# EasyEDA schematic Smart spectacles for drowsiness.json
TITLE: Smart spectacles for drowsiness; REV: 1.0; Date: 2022-01-13; Sheet: 1/1
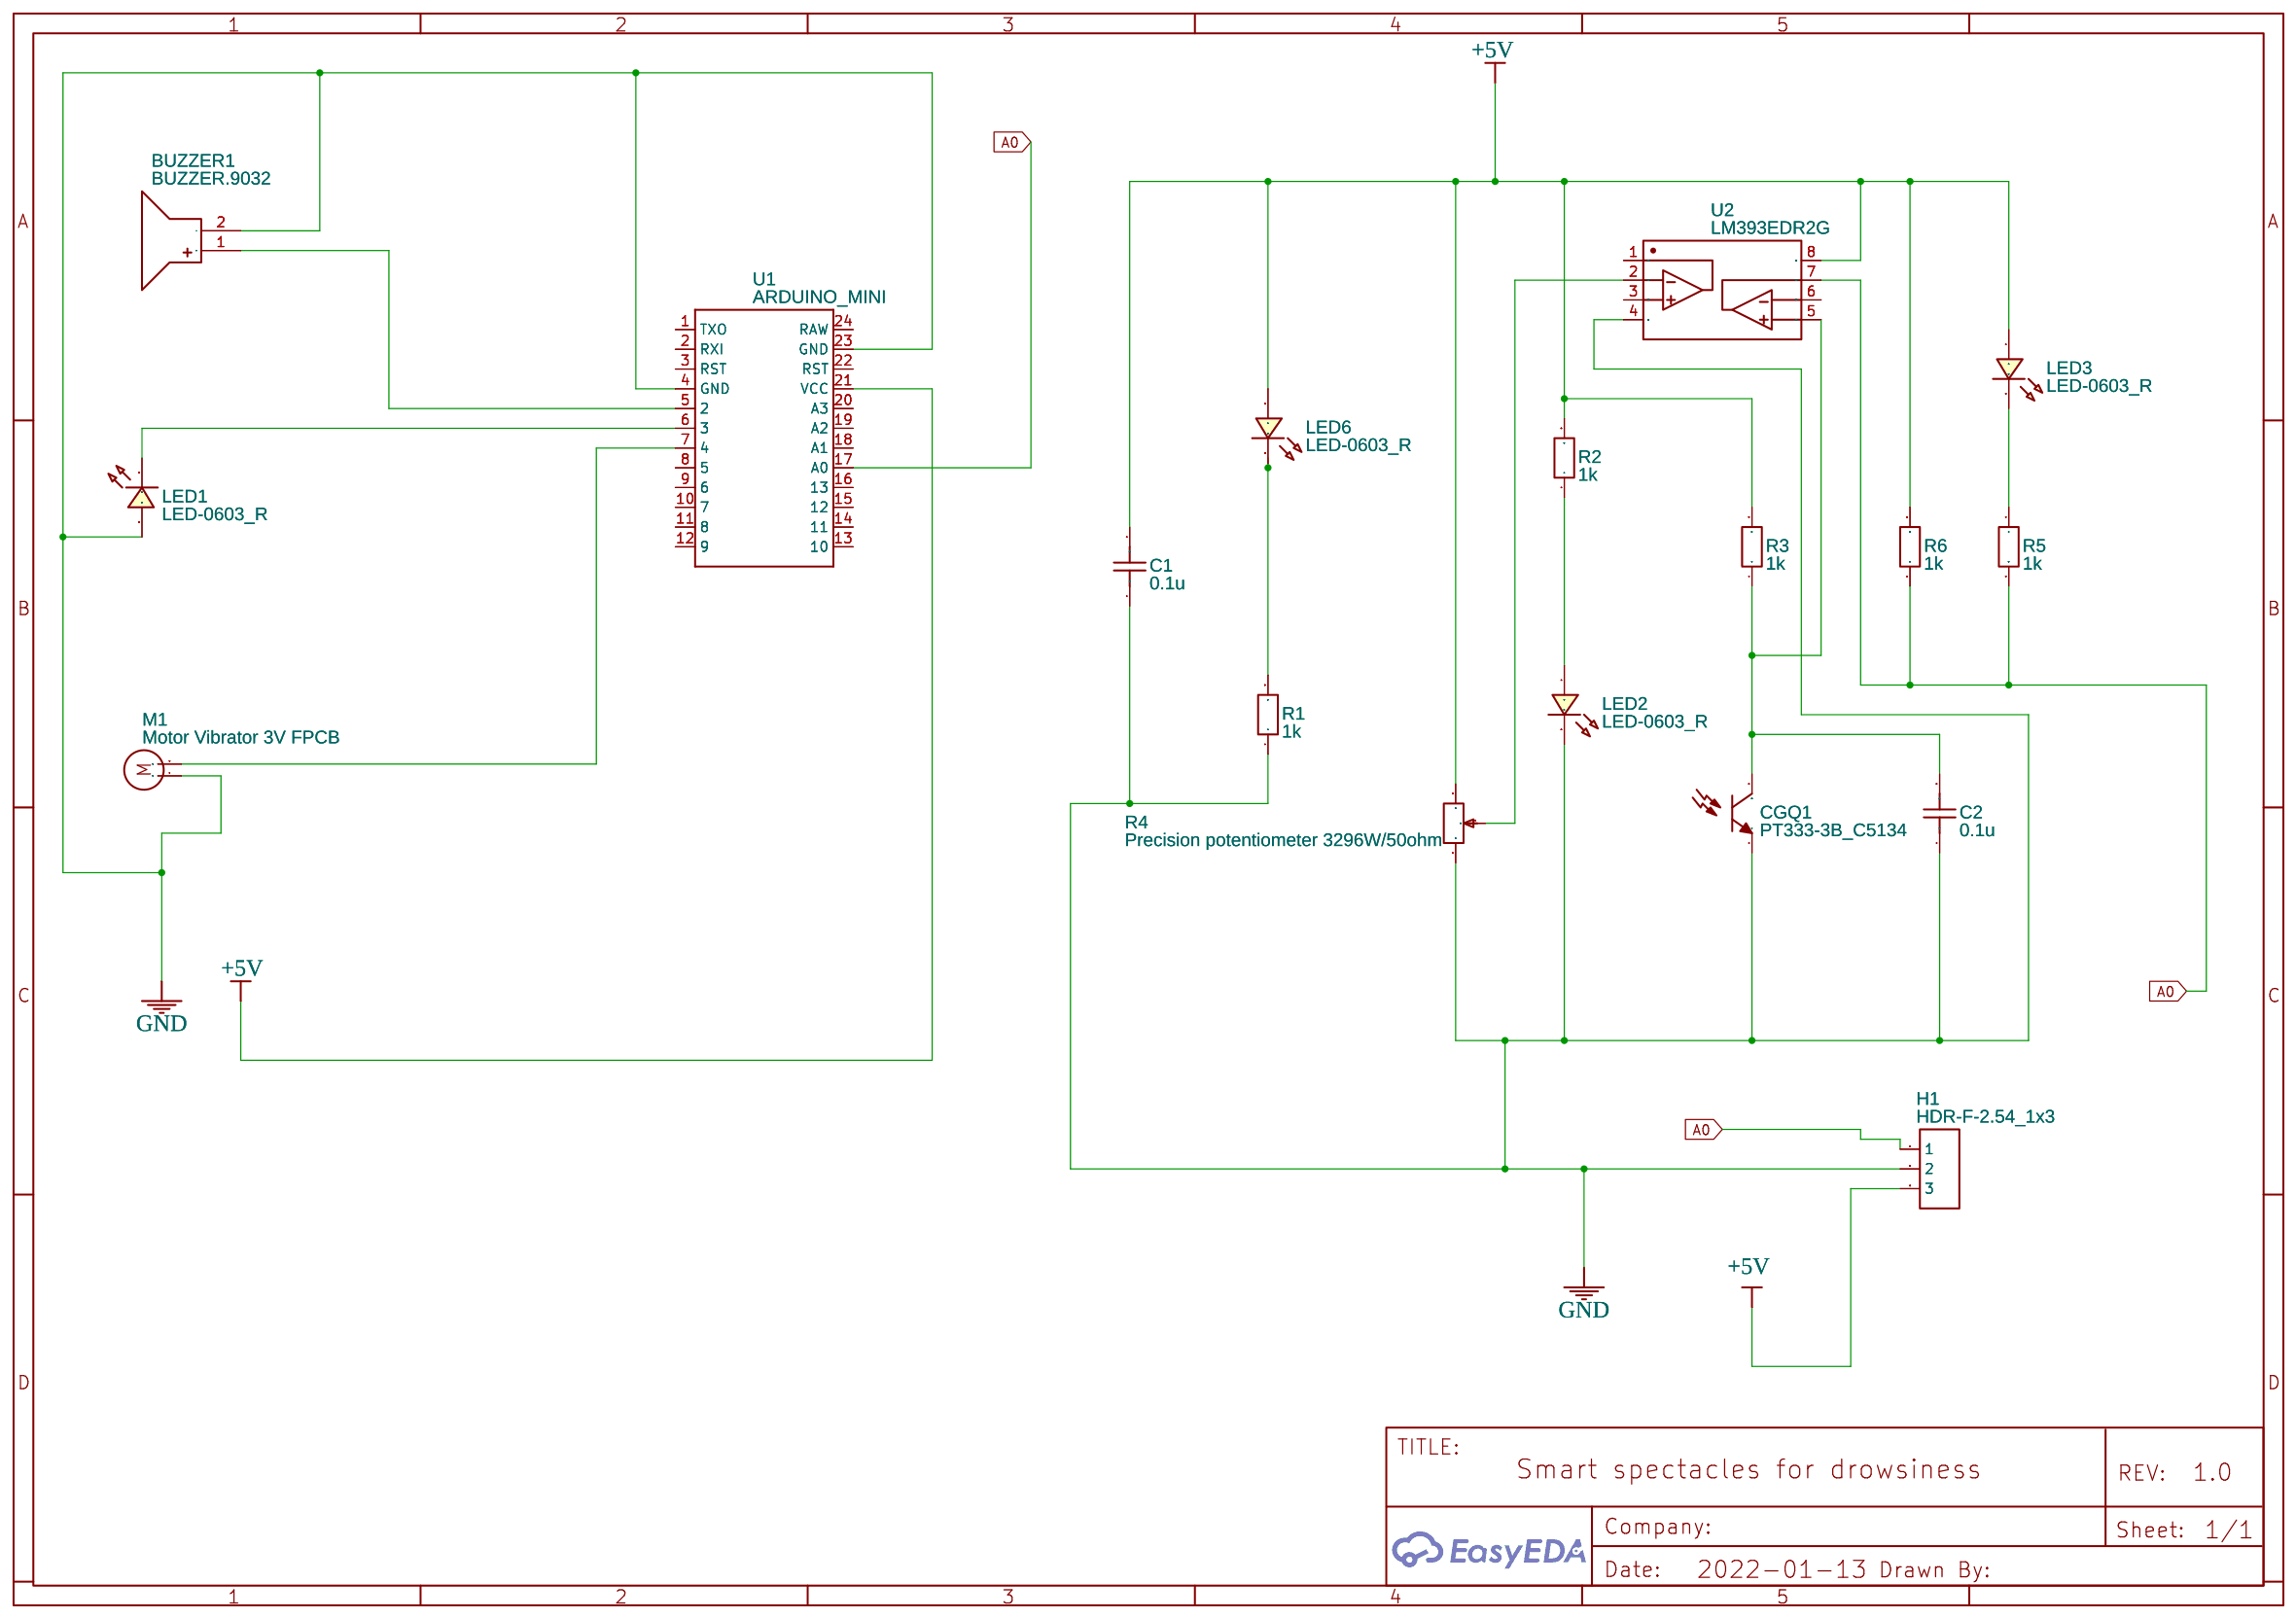
[diagram p0: schematic sheet]

## Parts
BUZZER1  BUZZER.9032  [BUZ-SMD_2P-L10.5-W9.0-P10.50-R]
C1  0.1u  [C0603]
C2  0.1u  [C0603]
CGQ1  PT333-3B_C5134  [SENSOR-TH_PT333-3B]
H1  HDR-F-2.54_1x3  [HDR-F-2.54_1X3]
LED1  LED-0603_R  [LED0603_RED]
LED2  LED-0603_R  [LED0603_RED]
LED3  LED-0603_R  [LED0603_RED]
LED6  LED-0603_R  [LED0603_RED]
M1  Motor Vibrator 3V FPCB  [MOTOR VIBRATOR 3V FPCB]
R1  1k  [R0603]
R2  1k  [R0603]
R3  1k  [R0603]
R4  Precision potentiometer 3296W/50ohm  [RES-ADJ-TH_3296W]
R5  1k  [R0603]
R6  1k  [R0603]
U1  ARDUINO_MINI  [ARDUINO_MINI]
U2  LM393EDR2G  [SOIC-8_L5.0-W4.0-P1.27-LS6.0-BL]

## Library data of the parts
BUZZER1 = BUZZER.9032: Supplier: LCSC; Supplier Part: C9900002564; Contributor: LCSC
C1 C2 = C_0603_US: Contributor: LCEDA_Lib
CGQ1 = PT333-3B_C5134: Supplier: LCSC; Manufacturer: EVERLIGHT; Manufacturer Part: PT333-3B; Supplier Part: C5134; Contributor: 立创EDA官方封装库; JLCPCB Part Class: Extended Part
H1 = HDR-F-2.54_1x3: Supplier Part: C146690; Supplier: LCSC; Contributor: LCEDA_Lib
LED1-LED3 LED6 = LED-0603_R: Manufacturer: EVERLIGHT(台湾亿光); Manufacturer Part: 19-217/R6C-AL1M2VY/3T; Supplier Part: C72044; Supplier: LCSC; Contributor: LCEDA_01
M1 = Motor Vibrator 3V FPCB: Supplier Part: C0827B020F; Contributor: David Castillo
R1-R3 R5 R6 = R_0603_EU: Contributor: LCEDA_Lib
R4 = Precision potentiometer 3296W/50ohm: Supplier Part: C21881; Supplier: LCSC; Manufacturer: ReliaPro
U1 = ARDUINO_MINI: Arduino Pro Mini footprint; Contributor: SparkFun
U2 = LM393EDR2G: Supplier: LCSC; Supplier Part: C152730; Manufacturer: ON Semicon; Contributor: LCSC; JLCPCB Part Class: Extended Part

## Nets
+5V: C1.2 H1.3 LED3.1 LED6.1 R2.2 R3.2 R4.3 R6.2 U1.21(VCC) U2.8(VCC)
GND: BUZZER1.2(-) C1.1 C2.1 CGQ1.1(E) H1.2 LED1.1 LED2.2 M1.1 R1.1 R4.1 U1.4(GND) U1.23(GND) U2.4(GND)
A0: H1.1 R5.2 R6.1 U1.17(A0) U2.7(OUT2)
Net-(BUZZER1-1): BUZZER1.1(+) U1.5(2)
Net-(C2-2): C2.2 CGQ1.2(C) R3.1 U2.5(IN2+)
Net-(LED1-2): LED1.2 U1.6(3)
Net-(LED2-1): LED2.1 R2.1
Net-(LED3-2): LED3.2 R5.1
Net-(LED6-2): LED6.2 R1.2
Net-(M1-2): M1.2 U1.7(4)
Net-(R4-2): R4.2 U2.2(IN1-)

Not connected (* = marked no-connect by the designer): U1 1(TXO) 2(RXI) 3(RST) 8(5) 9(6) 10(7) 11(8) 12(9) 13(10) 14(11) 15(12) 16(13) 18(A1) 19(A2) 20(A3) 22(RST) 24(RAW); U2 1(OUT1) 3(IN1+) 6(IN2-)
